# Altium schematic sheet CONNECTOR_EXP.SchDoc
size A3; SheetNumber: 4; SheetTotal: 23
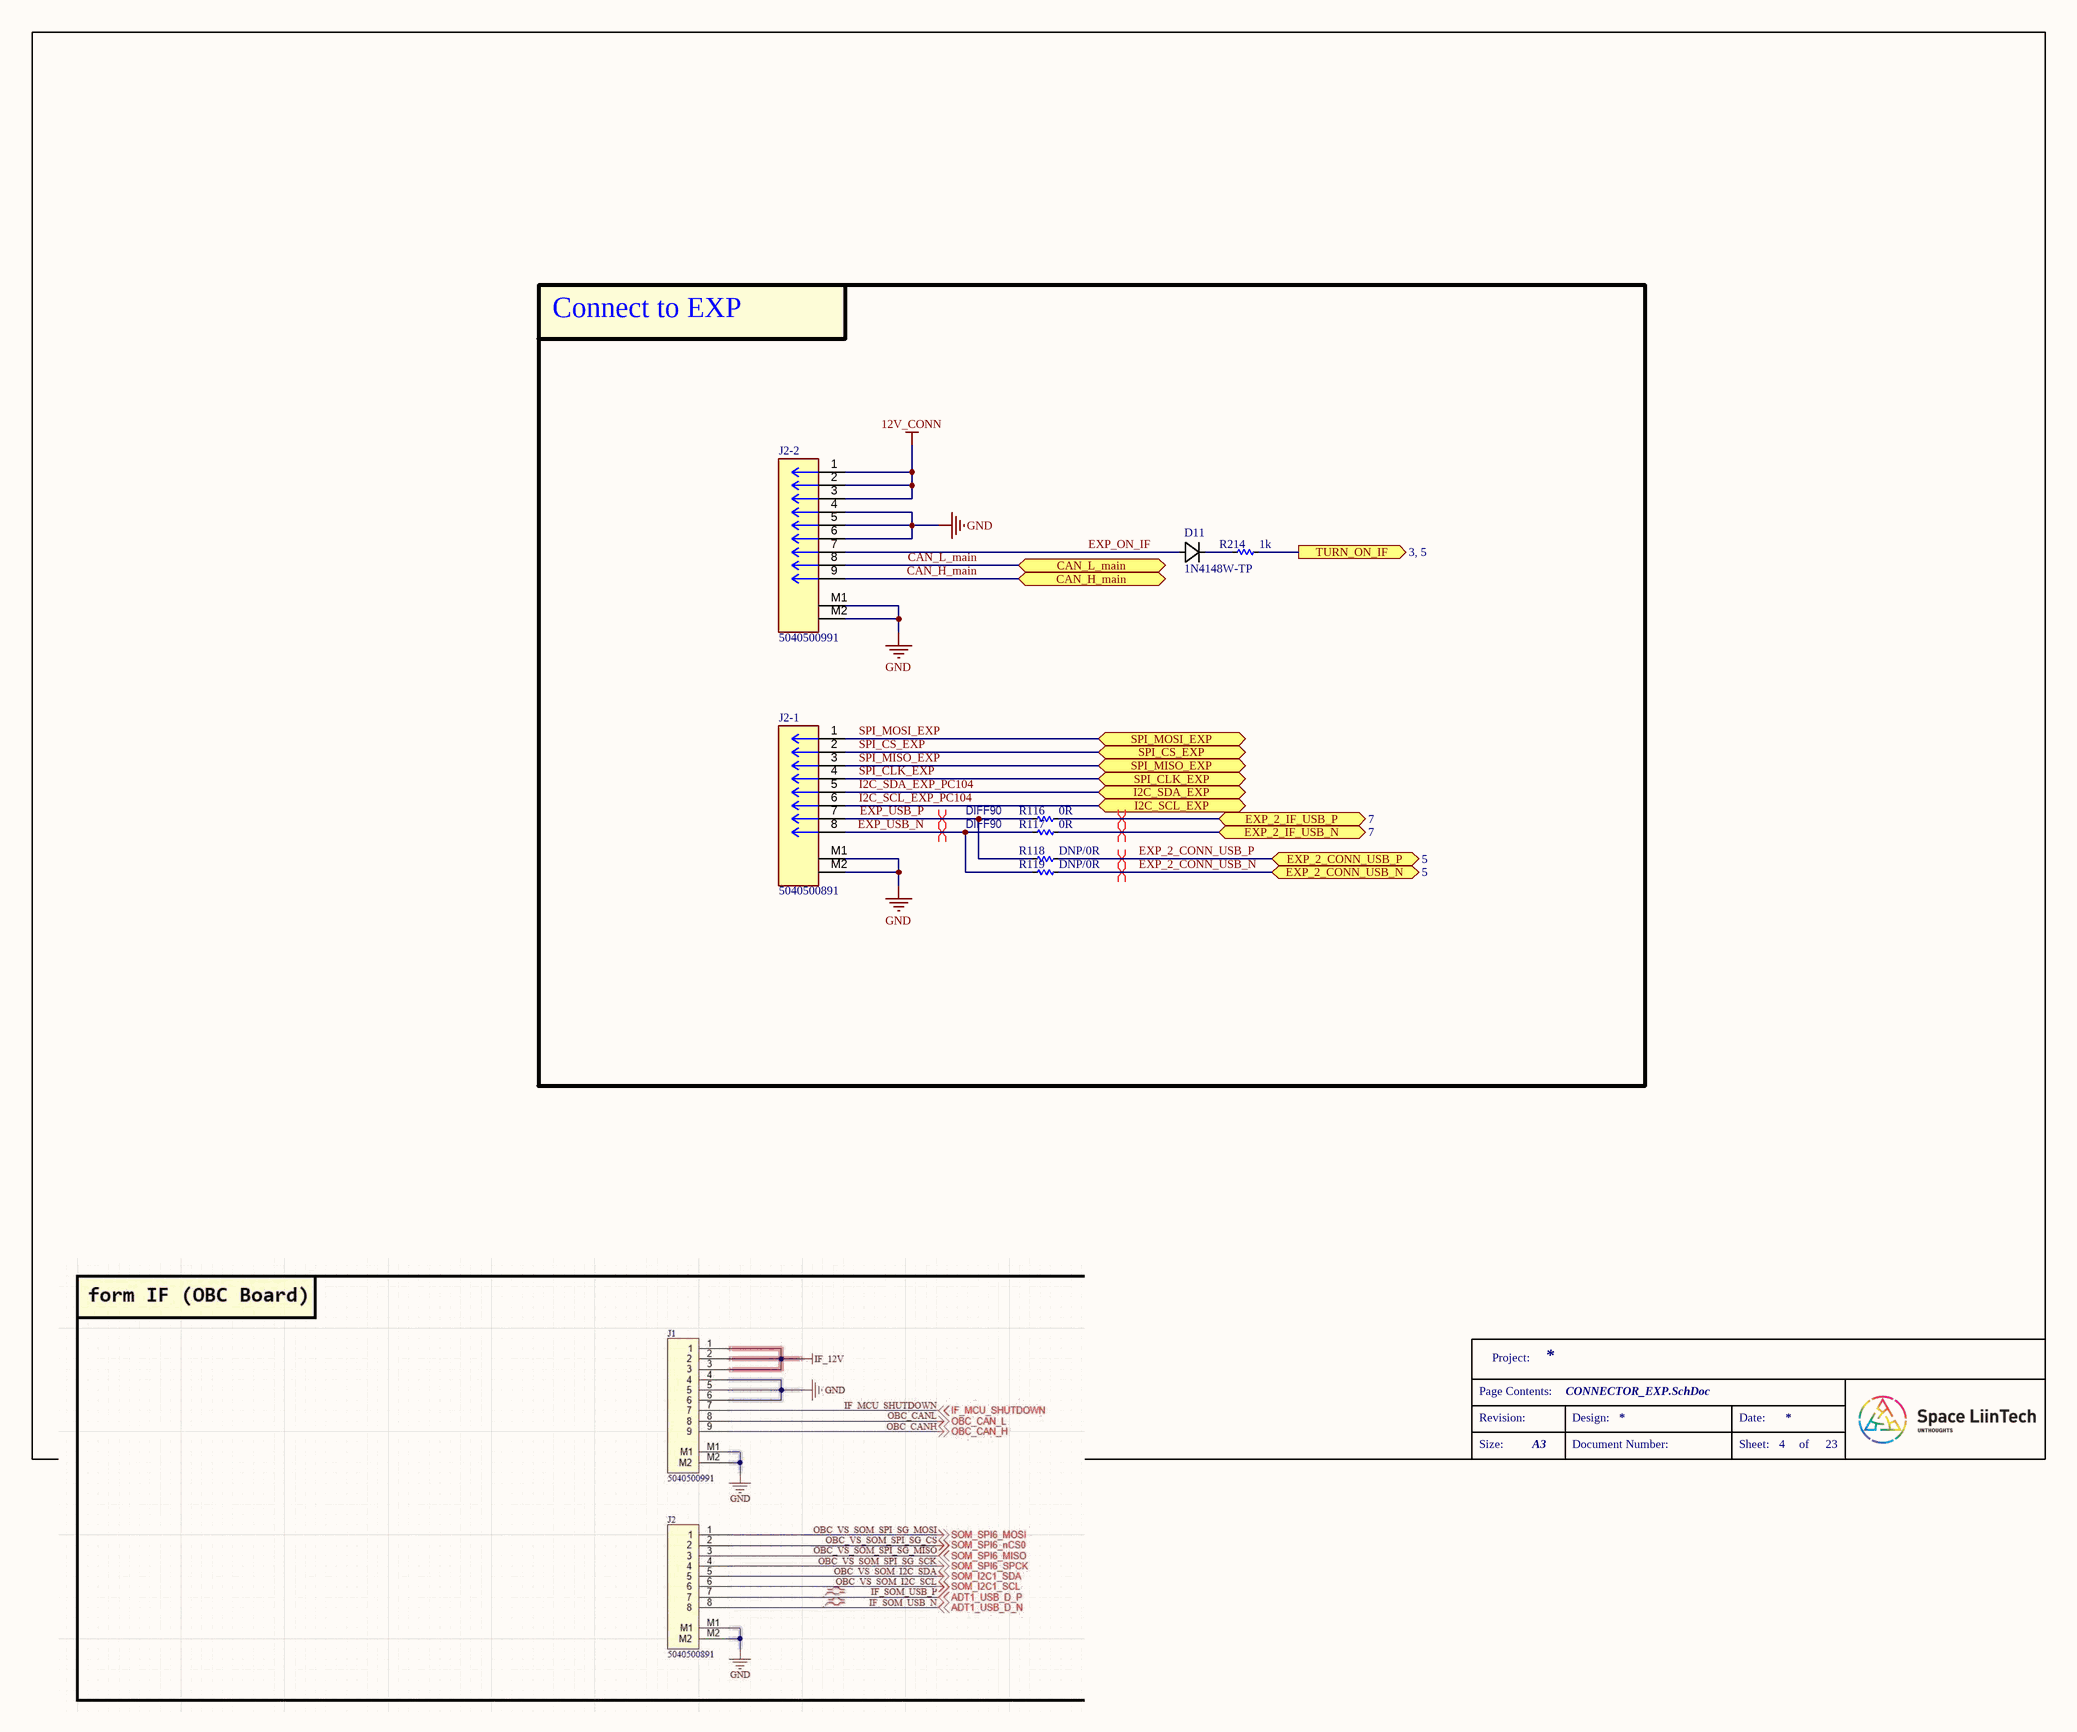
[diagram p0: CONNECTOR_EXP.SchDoc]

## Parts
D11  1N4148W-TP  [SOD123_MCC]
J2-1  5040500891  [MOLEX_5040500891]
J2-2  5040500991  [MOLEX_5040500991]
R116  0R  [RES_C_0603X30]
R117  0R  [RES_C_0603X30]
R118  DNP/0R  [RES_C_0603X30]
R119  DNP/0R  [RES_C_0603X30]
R214  1k  [RES_C_1005x30_L]

## Blocks framed on the sheet
Connect to EXP: D11 J2-1 J2-2 R116-R119 R214

## Ports
CAN_H_main (bidir, see 5, 19), CAN_L_main (bidir, see 5, 19), EXP_2_CONN_USB_N (bidir, see 5), EXP_2_CONN_USB_P (bidir, see 5), EXP_2_IF_USB_N (bidir, see 7), EXP_2_IF_USB_P (bidir, see 7), I2C_SCL_EXP (bidir, see 5, 8), I2C_SDA_EXP (bidir, see 5, 8), SPI_CLK_EXP (bidir, see 5), SPI_CS_EXP (bidir, see 5), SPI_MISO_EXP (bidir, see 5), SPI_MOSI_EXP (bidir, see 5), TURN_ON_IF (out, see 3, 5)

## Nets
12V_CONN: J2-2.1 J2-2.2 J2-2.3
GND: J2-1.M1 J2-1.M2 J2-2.4 J2-2.5 J2-2.6 J2-2.M1 J2-2.M2
CAN_H_main: J2-2.9 ; port CAN_H_main
CAN_L_main: J2-2.8 ; port CAN_L_main
EXP_2_CONN_USB_N: R119.2 ; port EXP_2_CONN_USB_N
EXP_2_CONN_USB_P: R118.2 ; port EXP_2_CONN_USB_P
EXP_2_IF_USB_N: R117.2 ; port EXP_2_IF_USB_N
EXP_2_IF_USB_P: R116.2 ; port EXP_2_IF_USB_P
EXP_ON_IF: D11.2 J2-2.7
EXP_USB_N: J2-1.8 R117.1 R119.1
EXP_USB_P: J2-1.7 R116.1 R118.1
I2C_SCL_EXP_PC104: J2-1.6 ; port I2C_SCL_EXP
I2C_SDA_EXP_PC104: J2-1.5 ; port I2C_SDA_EXP
SPI_CLK_EXP: J2-1.4 ; port SPI_CLK_EXP
SPI_CS_EXP: J2-1.2 ; port SPI_CS_EXP
SPI_MISO_EXP: J2-1.3 ; port SPI_MISO_EXP
SPI_MOSI_EXP: J2-1.1 ; port SPI_MOSI_EXP
TURN_ON_IF: R214.2 ; port TURN_ON_IF
NetD11_1: D11.1 R214.1

## Layout directives
differential pair; differential pair class DIFF90; net class DIFF90; rule Matched Net Lengths [Tolerance = 4mil]: EXP_2_CONN_USB_N, EXP_2_CONN_USB_P, EXP_2_IF_USB_N, EXP_2_IF_USB_P, EXP_USB_N, EXP_USB_P

## Notes on the sheet
- Project:
- Page Contents:
- Revision:
- Design:
- Date:
- Size:
- A3
- Document Number:
- Sheet:
- of

## Library data of the parts
D11 = 1N4148W-TP: Description; Manufacturer_Name: MCC; Copyright: Copyright (C) 2026 Ultra Librarian. All rights reserved.; Manufacturer_Part_Number: 1N4148W-TP
J2-1 = 5040500891: Connector Header Surface Mount, Right Angle 8 position 0.059" (1.50mm)`
J2-2 = 5040500991: Connector Header Surface Mount, Right Angle 9 position 0.059" (1.50mm)
R116-R119 R214 = _RES_B_2: RES